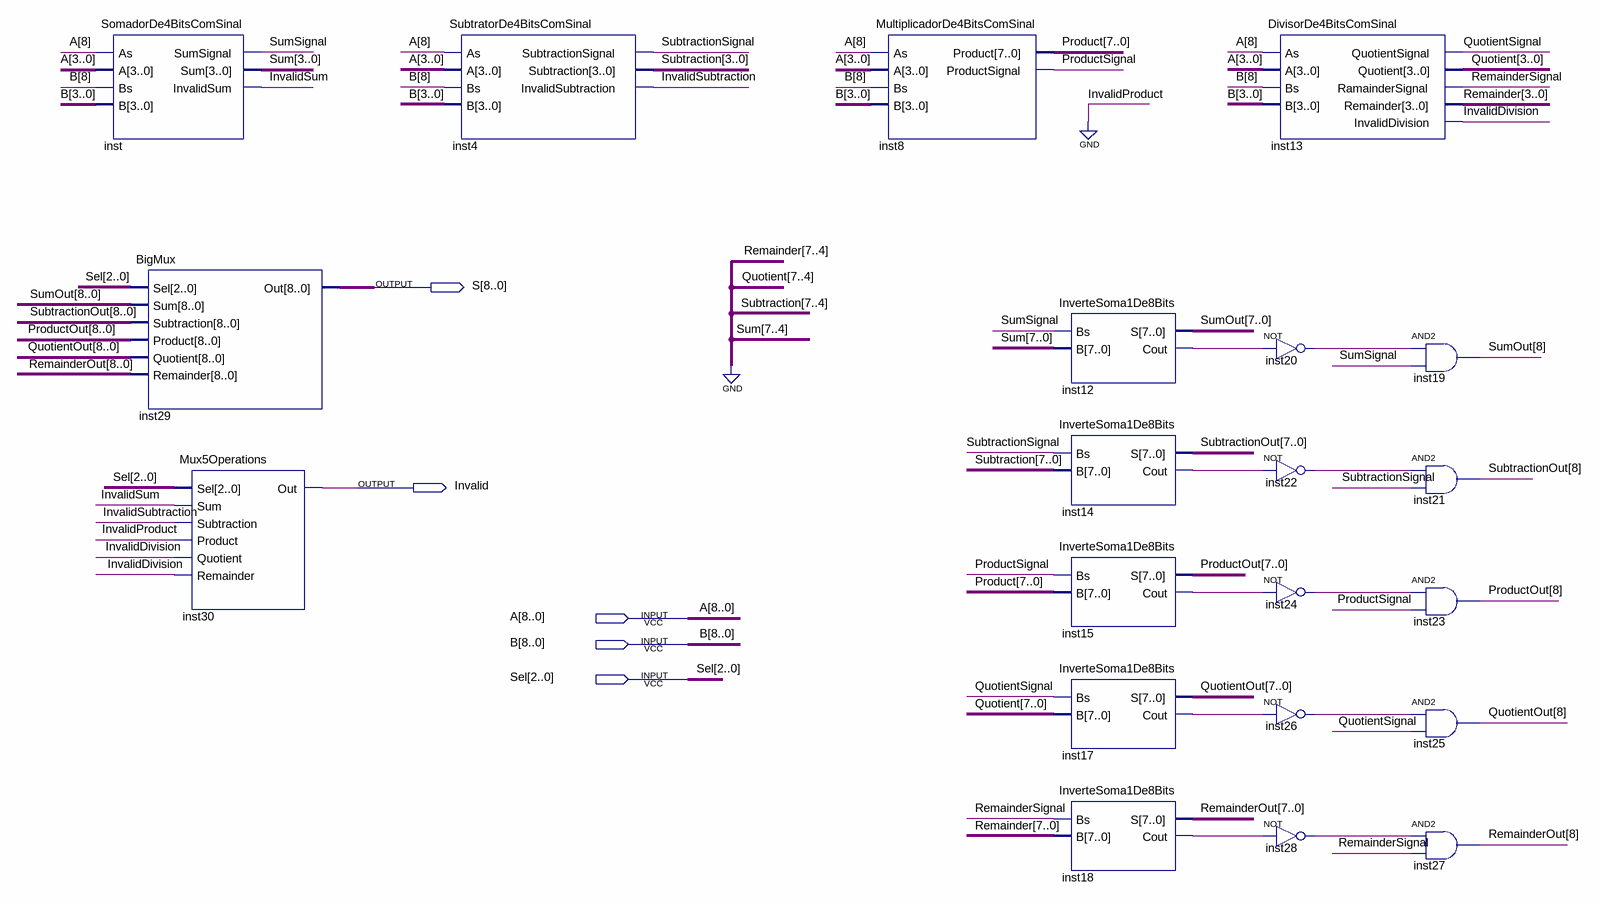
[diagram p0: schematic sheet]
// Quartus schematic Calculadora.bdf as structural Verilog: 21 symbols, 5 pins
module Calculadora (
  input  [8:0] A,
  input  [8:0] B,
  input  [2:0] Sel,
  output [8:0] S,
  output Invalid
);

  wire inst12_cout, inst14_cout, inst15_cout, inst17_cout, inst18_cout, inst20_out, inst22_out, inst24_out,
       inst26_out, inst28_out, InvalidDivision, InvalidSubtraction, InvalidSum, ProductSignal,
       QuotientSignal, RemainderSignal, SubtractionSignal, SumSignal;
  wire [3:0] Sum;
  wire [7:0] Product, Quotient, Remainder, Subtraction;
  wire [8:0] ProductOut, QuotientOut, RemainderOut, SubtractionOut, SumOut;

  SomadorDe4BitsComSinal inst (
    .As(A[8]), .A(A[3:0]), .Bs(B[8]), .B(B[3:0]), .SumSignal(SumSignal), .Sum(Sum), .InvalidSum(InvalidSum));
  BigMux inst29 (
    .Sel(Sel), .Sum(SumOut), .Subtraction(SubtractionOut), .Product(ProductOut), .Quotient(QuotientOut),
    .Remainder(RemainderOut), .Out(S));
  Mux5Operations inst30 (
    .Sel(Sel), .Sum(InvalidSum), .Subtraction(InvalidSubtraction), .Product(1'b0),
    .Quotient(InvalidDivision), .Remainder(InvalidDivision), .Out(Invalid));
  SubtratorDe4BitsComSinal inst4 (
    .As(A[8]), .A(A[3:0]), .B(B[3:0]), .Bs(B[8]), .SubtractionSignal(SubtractionSignal),
    .Subtraction(Subtraction[3:0]), .InvalidSubtraction(InvalidSubtraction));
  MultiplicadorDe4BitsComSinal inst8 (
    .As(A[8]), .A(A[3:0]), .Bs(B[8]), .B(B[3:0]), .Product(Product), .ProductSignal(ProductSignal));
  InverteSoma1De8Bits inst12 (.B({4'b0000, Sum}), .Bs(SumSignal), .S(SumOut[7:0]), .Cout(inst12_cout));
  InverteSoma1De8Bits inst14 (.B(Subtraction), .Bs(SubtractionSignal), .S(SubtractionOut[7:0]), .Cout(inst14_cout));
  InverteSoma1De8Bits inst15 (.B(Product), .Bs(ProductSignal), .S(ProductOut[7:0]), .Cout(inst15_cout));
  InverteSoma1De8Bits inst17 (.B(Quotient), .Bs(QuotientSignal), .S(QuotientOut[7:0]), .Cout(inst17_cout));
  InverteSoma1De8Bits inst18 (.B(Remainder), .Bs(RemainderSignal), .S(RemainderOut[7:0]), .Cout(inst18_cout));
  DivisorDe4BitsComSinal inst13 (
    .As(A[8]), .A(A[3:0]), .Bs(B[8]), .B(B[3:0]), .QuotientSignal(QuotientSignal),
    .RamainderSignal(RemainderSignal), .InvalidDivision(InvalidDivision), .Quotient(Quotient[3:0]),
    .Remainder(Remainder[3:0]));
  not inst20 (inst20_out, inst12_cout);
  not inst22 (inst22_out, inst14_cout);
  not inst24 (inst24_out, inst15_cout);
  not inst26 (inst26_out, inst17_cout);
  not inst28 (inst28_out, inst18_cout);
  and inst19 (SumOut[8], inst20_out, SumSignal);
  and inst21 (SubtractionOut[8], inst22_out, SubtractionSignal);
  and inst23 (ProductOut[8], inst24_out, ProductSignal);
  and inst25 (QuotientOut[8], inst26_out, QuotientSignal);
  and inst27 (RemainderOut[8], inst28_out, RemainderSignal);
endmodule
